# Altium schematic sheet Ethernet_SD_Card.SchDoc
size A
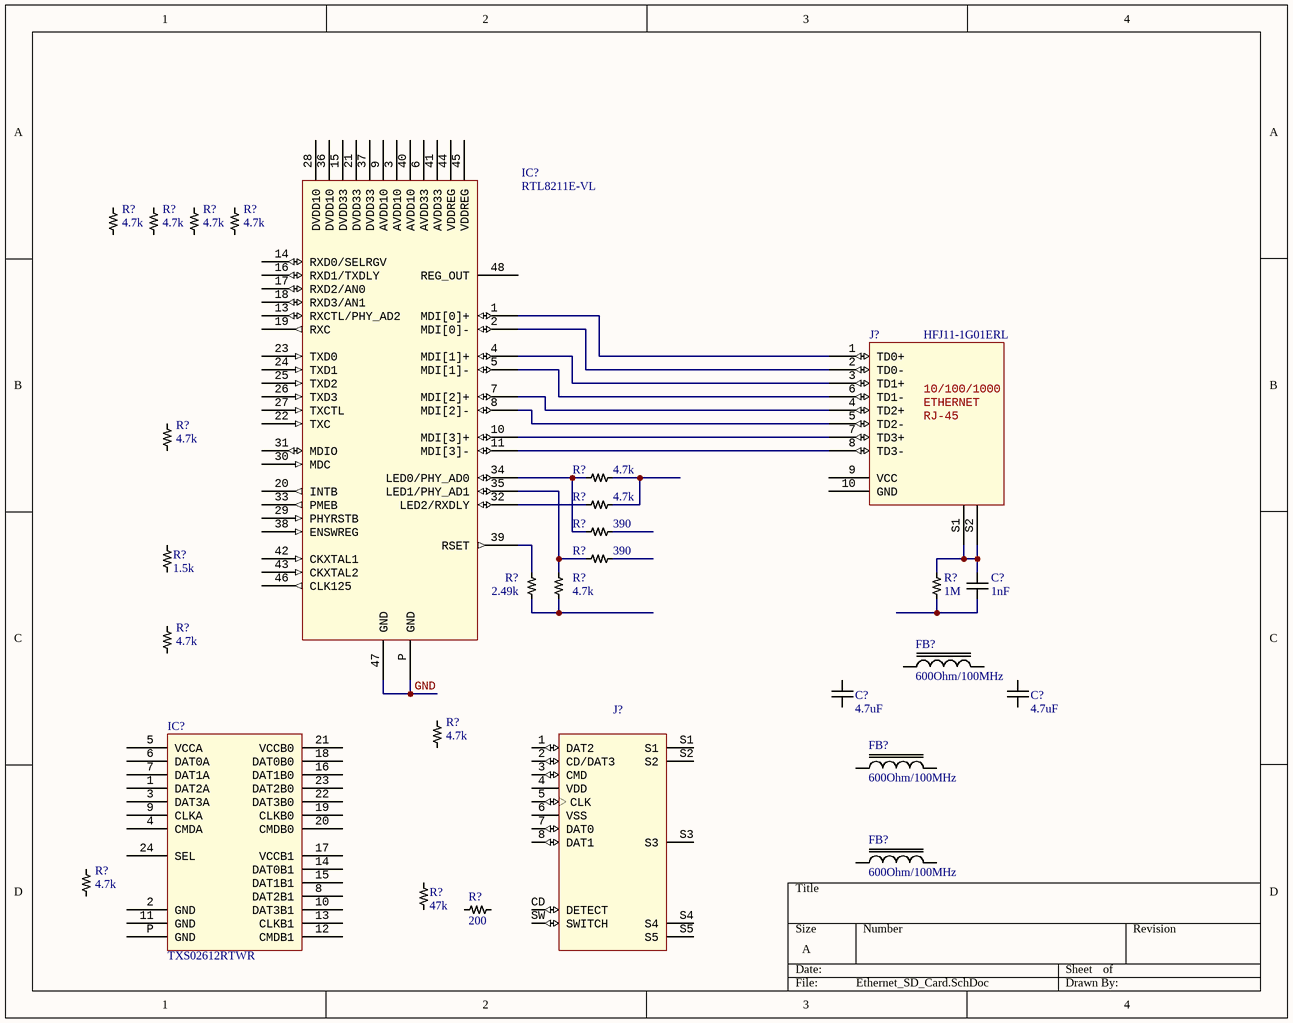
[diagram p0: Ethernet_SD_Card.SchDoc]

## Parts
(Parts that share a designator on the sheet are numbered #1, #2 ... from top to bottom, then left to right.)
C?#1  1nF  [CAP0402]
C?#2  4.7uF  [CAP0805]
C?#3  4.7uF  [CAP0805]
FB?#1  600Ohm/100MHz  [FB0805]
FB?#2  600Ohm/100MHz  [FB0805]
FB?#3  600Ohm/100MHz  [FB0805]
IC?#1  RTL8211E-VL  [QFN48]
IC?#2  TXS02612RTWR  [WQFN24]
J?#1  HFJ11-1G01ERL  [HFJ11-1G01ERL]
J?#2  5031821852  [5031821852]  (value not drawn)
R?#1  4.7k  [RES0402]
R?#2  4.7k  [RES0402]
R?#3  4.7k  [RES0402]
R?#4  4.7k  [RES0402]
R?#5  4.7k  [RES0402]
R?#6  4.7k  [RES0402]
R?#7  4.7k  [RES0402]
R?#8  390  [RES0402]
R?#9  1.5k  [RES0402]
R?#10  390  [RES0402]
R?#11  2.49k  [RES0402]
R?#12  4.7k  [RES0402]
R?#13  1M  [RES0402]
R?#14  4.7k  [RES0402]
R?#15  4.7k  [RES0402]
R?#16  4.7k  [RES0402]
R?#17  47k  [RES0402]
R?#18  200  [RES0402]

## Nets
GND: IC?#1.47(GND) IC?#1.P(GND)
NetC?#1_1: C?#1.1 J?#1.S1(SHD1) J?#1.S2(SHD2) R?#13.2
NetC?#1_2: C?#1.2 R?#13.1
NetIC?#1_1: IC?#1.1(MDI[0]+) J?#1.1(TD0+)
NetIC?#1_2: IC?#1.2(MDI[0]-) J?#1.2(TD0-)
NetIC?#1_4: IC?#1.4(MDI[1]+) J?#1.3(TD1+)
NetIC?#1_5: IC?#1.5(MDI[1]-) J?#1.6(TD1-)
NetIC?#1_7: IC?#1.7(MDI[2]+) J?#1.4(TD2+)
NetIC?#1_8: IC?#1.8(MDI[2]-) J?#1.5(TD2-)
NetIC?#1_10: IC?#1.10(MDI[3]+) J?#1.7(TD3+)
NetIC?#1_11: IC?#1.11(MDI[3]-) J?#1.8(TD3-)
NetIC?#1_32: IC?#1.32(LED2/RXDLY) R?#7.2
NetIC?#1_34: IC?#1.34(LED0/PHY_AD0) R?#6.2 R?#8.1
NetIC?#1_35: IC?#1.35(LED1/PHY_AD1) R?#10.1 R?#12.2
NetIC?#1_39: IC?#1.39(RSET) R?#11.2
NetR?#6_1: R?#6.1 R?#7.1
NetR?#11_1: R?#11.1 R?#12.1

Not connected (* = marked no-connect by the designer): C?#2 1 2; C?#3 1 2; FB?#1 1 2; FB?#2 1 2; FB?#3 1 2; IC?#1 3(AVDD10) 6(AVDD33) 9(AVDD10) 13(RXCTL/PHY_AD2) 14(RXD0/SELRGV) 15(DVDD33) 16(RXD1/TXDLY) 17(RXD2/AN0) 18(RXD3/AN1) 19(RXC) 20(INTB) 21(DVDD33) 22(TXC) 23(TXD0) 24(TXD1) 25(TXD2) 26(TXD3) 27(TXCTL) 28(DVDD10) 29(PHYRSTB) 30(MDC) 31(MDIO) 33(PMEB) 36(DVDD10) 37(DVDD33) 38(ENSWREG) 40(AVDD10) 41(AVDD33) 42(CKXTAL1) 43(CKXTAL2) 44(VDDREG) 45(VDDREG) 46(CLK125) 48(REG_OUT); IC?#2 1(DAT2A) 2(GND) 3(DAT3A) 4(CMDA) 5(VCCA) 6(DAT0A) 7(DAT1A) 8(DAT2B1) 9(CLKA) 10(DAT3B1) 11(GND) 12(CMDB1) 13(CLKB1) 14(DAT0B1) 15(DAT1B1) 16(DAT1B0) 17(VCCB1) 18(DAT0B0) 19(CLKB0) 20(CMDB0) 21(VCCB0) 22(DAT3B0) 23(DAT2B0) 24(SEL) P(GND); J?#1 9(VCC) 10(GND); J?#2 1(DAT2) 2(CD/DAT3) 3(CMD) 4(VDD) 5(CLK) 6(VSS) 7(DAT0) 8(DAT1) CD(DETECT) S1 S2 S3 S4 S5 SW(SWITCH); R?#1 1 2; R?#2 1 2; R?#3 1 2; R?#4 1 2; R?#5 1 2; R?#8 2; R?#9 1 2; R?#10 2; R?#14 1 2; R?#15 1 2; R?#16 1 2; R?#17 1 2; R?#18 1 2

## Notes on the sheet
- (in symbol HFJ11-1G01ERL) 10/100/1000; ETHERNET; RJ-45

## Library data of the parts
C?#1 = GCM155R71H102KA37D: MLCC 1nF 0402 SMD; Manufacturer: Murata; Voltage Rating: 50V; Tolerance: 10%; Dielectric: X7R; Supplier 1: Digi-Key; Manufacturer Part Number: GCM155R71H102KA37D; Stock 1: 18060146; Pricing 1: 1=0.10000, 10=0.03900, 100=0.01720, 500=0.01228, 1000=0.00965, 2500=0.00878, 5000=0.00807 (USD); RoHS: Yes; Mount: Surface Mount; Case/Package: 0402; Case Code (Metric): 1005; Case Code (Imperial): 0402; Min Operating Temperature: -55°C; Max Operating Temperature: 125°C; Package Quantity: 1; Capacitance: 1nF; Packaging: Tape and Reel; Voltage Rating (DC): 50V; Termination: SMD/SMT; Voltage: 50V; Length: 1mm; Height: 0.5mm; Width: 0.02inch; Thickness: 0.022inch; Depth: 0.5mm; Ratings: AEC-Q200; Radiation Hardening: No; REACH SVHC: No SVHC; Lead Free: Lead Free; ComponentLink1URL: https://datasheet.ciiva.com/130/product-130720.pdf?src-supplier=Digi-Key; ComponentLink1Description: https://datasheet.ciiva.com/130/product-130720.pdf?src-supplier=Digi-Key; ComponentLink2URL: https://datasheet.ciiva.com/18183/getdatasheetpartid-140970-18183520.pdf?src-supplier=Verical; ComponentLink2Description: https://datasheet.ciiva.com/18183/getdatasheetpartid-140970-18183520.pdf?src-supplier=Verical; ComponentLink3URL: https://datasheet.ciiva.com/3778/3103gcm155r71h102ka3723-3778878.pdf?src-supplier=Arrow; ComponentLink3Description: https://datasheet.ciiva.com/3778/3103gcm155r71h102ka3723-3778878.pdf?src-supplier=Arrow; ComponentLink4URL: https://datasheet.ciiva.com/11786/0900766b80ef92d0-11786143.pdf?src-supplier=RSComponents; ComponentLink4Description: https://datasheet.ciiva.com/11786/0900766b80ef92d0-11786143.pdf?src-supplier=RSComponents; ComponentLink5URL: https://datasheet.ciiva.com/16213/product-16213384.pdf?src-supplier=Future+Electronics; ComponentLink5Description: https://datasheet.ciiva.com/16213/product-16213384.pdf?src-supplier=Future+Electronics
C?#2 C?#3 = C2012X7R1A475K085AC: MLCC 4.7uF 0805 SMD; Manufacturer: TDK; Dielectric Material: Ceramic; Tolerance: 10%; Voltage Rating: 10V; Dielectric: X7R; Supplier 1: Digi-Key; Manufacturer Part Number: C2012X7R1A475K085AC; Stock 1: 87407; Pricing 1: 1=0.22000, 10=0.15200, 100=0.08600, 500=0.06072, 1000=0.05313 (USD); RoHS: Yes; Mount: Surface Mount; Case/Package: 0805; Case Code (Metric): 2012; Case Code (Imperial): 0805; Min Operating Temperature: -55°C; Max Operating Temperature: 125°C; Package Quantity: 4000; Packaging: Cut Tape; Capacitance: 4.7uF; Voltage Rating (DC): 10V; Length: 0.079inch; Width: 0.049inch; Thickness: 0.039inch; REACH SVHC: No SVHC; Lead Free: Lead Free; ComponentLink1URL: https://datasheet.ciiva.com/14886/tdkmlcccaprange-14886121.pdf?src-supplier=Digi-Key; ComponentLink1Description: https://datasheet.ciiva.com/14886/tdkmlcccaprange-14886121.pdf?src-supplier=Digi-Key; ComponentLink2Description: https://product.tdk.com/info/en/catalog/datasheets/mlcc_commercial_general_en.pdf; ComponentLink2URL: https://product.tdk.com/info/en/catalog/datasheets/mlcc_commercial_general_en.pdf
FB?#1-FB?#3 = HZ0805E601R-10: Ferrite Bead 600Ohm/100MHz 0805 SMD; Manufacturer: Laird; Current Rating: 500mA; Impedance: 600R; Number of Lines: 1; DC Resistance (DCR): 300mR; Test Frequency: 100MHz; Supplier 1: Digi-Key; Manufacturer Part Number: HZ0805E601R-10; Stock 1: 4500868; Pricing 1: 1=0.10000, 10=0.04700, 25=0.04160, 50=0.03800, 100=0.03420, 250=0.02504, 500=0.01822, 1000=0.01784 (USD); RoHS: Yes; Mount: Surface Mount; Case/Package: 0805; Weight: 0.00392oz; Case Code (Metric): 2012; Case Code (Imperial): 0805; Material: Ferrite; Contact Plating: Tin,Matte; Core Material: Ferrite; Min Operating Temperature: -40°C; Max Operating Temperature: 125°C; Package Quantity: 1; Packaging: Tape and Reel; Max Current Rating: 500mA; Max DC Current: 500mA; Termination: SMD/SMT; Frequency: 100MHz; Length: 2mm; Height: 1.25mm; Width: 0.049inch; Depth: 1.45mm; REACH SVHC: Unknown; Lead Free: Lead Free; ComponentLink1URL: https://datasheet.ciiva.com/22622/1685710-22622833.pdf?src-supplier=Element14; ComponentLink1Description: https://datasheet.ciiva.com/22622/1685710-22622833.pdf?src-supplier=Element14; ComponentLink2URL: https://datasheet.ciiva.com/1013/hz0805e601r-10-1013170.pdf?src-supplier=Digi-Key; ComponentLink2Description: https://datasheet.ciiva.com/1013/hz0805e601r-10-1013170.pdf?src-supplier=Digi-Key; ComponentLink3URL: https://datasheet.ciiva.com/8512/hz0805e601r-10-a-vp-8512772.pdf?src-supplier=Avnet; ComponentLink3Description: https://datasheet.ciiva.com/8512/hz0805e601r-10-a-vp-8512772.pdf?src-supplier=Avnet; ComponentLink4URL: https://datasheet.ciiva.com/16714/70065439-16714006.pdf?src-supplier=Allied+Electronics; ComponentLink4Description: https://datasheet.ciiva.com/16714/70065439-16714006.pdf?src-supplier=Allied+Electronics
IC?#1 = RTL8211E-VL: Ethernet transceiver
IC?#2 = TXS02612RTWR: SDIO Port Expander 24WQFN; Manufacturer: Texas Instruments; Min Supply Voltage: 1.1V; Max Supply Voltage: 3.6V; Operating Supply Current: 36uA; Frequency: 60MHz; Number of Outputs: 12; Number of Bits: 4; Supplier 1: Digi-Key; Manufacturer Part Number: TXS02612RTWR; Stock 1: 47945; Pricing 1: 1=1.41000, 10=1.25800, 100=0.98080, 500=0.81020, 1000=0.63963 (USD); RoHS: Yes; Mount: Surface Mount; Number of Pins: 24; Contact Plating: Gold; Min Operating Temperature: -40°C; Max Operating Temperature: 85°C; Packaging: Tape and Reel; Package Quantity: 1; Interface: SDIO; Length: 4.15mm; Height: 0.75mm; Width: 4.15mm; Radiation Hardening: No; REACH SVHC: No SVHC; Lead Free: Lead Free; ComponentLink1URL: https://datasheet.ciiva.com/14194/txs02612-14194898.pdf?src-supplier=Avnet; ComponentLink1Description: https://datasheet.ciiva.com/14194/txs02612-14194898.pdf?src-supplier=Avnet; ComponentLink2URL: https://datasheet.ciiva.com/22652/1723912-22652098.pdf?src-supplier=Element14; ComponentLink2Description: https://datasheet.ciiva.com/22652/1723912-22652098.pdf?src-supplier=Element14; ComponentLink3URL: https://datasheet.ciiva.com/1784/txs02612-1784272.pdf?src-supplier=Digi-Key; ComponentLink3Description: https://datasheet.ciiva.com/1784/txs02612-1784272.pdf?src-supplier=Digi-Key; ComponentLink4URL: https://datasheet.ciiva.com/15134/getdatasheetpartid-225882-15134505.pdf?src-supplier=Verical; ComponentLink4Description: https://datasheet.ciiva.com/15134/getdatasheetpartid-225882-15134505.pdf?src-supplier=Verical; ComponentLink5URL: https://datasheet.ciiva.com/41460/001188030-da-01-en-ic-sdio-port-ex-txs02612rtwr-wqfn-24-tid-41460267.pdf?src-supplier=Conrad; ComponentLink5Description: https://datasheet.ciiva.com/41460/001188030-da-01-en-ic-sdio-port-ex-txs02612rtwr-wqfn-24-tid-41460267.pdf?src-supplier=Conrad
J?#1 = HFJ11-1G01ERL: Ethernet Jack; Manufacturer: HALO; Number of Contacts: 8; Number of Ports: 1; Gender: Female; Pitch: 2.54mm; Supplier 1: Avnet; Manufacturer Part Number: HFJ11-1G01ERL; Stock 1: 332; Pricing 1: 1=3.29546, 10=3.24930, 25=3.20442, 50=3.16076, 100=3.06878 (USD); RoHS: Yes; Mount: Through Hole; Case/Package: Module; Min Operating Temperature: 0°C; Max Operating Temperature: 70°C; Termination: Solder; Orientation: Right Angle; Packaging: Rail/Tube; Number of Positions Loaded: 8; Length: 15.88mm; Width: 15.88mm; Depth: 21.59mm; Radiation Hardening: No; Lead Free: Lead Free; ComponentLink1URL: https://datasheet.ciiva.com/11767/0900766b812ae499-11767976.pdf?src-supplier=RSComponents; ComponentLink1Description: https://datasheet.ciiva.com/11767/0900766b812ae499-11767976.pdf?src-supplier=RSComponents; ComponentLink2URL: https://datasheet.ciiva.com/16649/fastjack-gigabit-16649403.pdf?src-supplier=Avnet+Europe; ComponentLink2Description: https://datasheet.ciiva.com/16649/fastjack-gigabit-16649403.pdf?src-supplier=Avnet+Europe; ComponentLink3URL: https://datasheet.ciiva.com/3139/fastjack-gigabit-3139132.pdf?src-supplier=Avnet; ComponentLink3Description: https://datasheet.ciiva.com/3139/fastjack-gigabit-3139132.pdf?src-supplier=Avnet; ComponentLink4URL: https://datasheet.ciiva.com/16287/fastjack-gigabit-16287901.pdf?src-supplier=Future+Electronics; ComponentLink4Description: https://datasheet.ciiva.com/16287/fastjack-gigabit-16287901.pdf?src-supplier=Future+Electronics
J?#2 = 5031821852: MICRO SD NORMAL ULTRALOWPRO8CKTE; MF: Molex; Digi-Key_Part_Number: WM12834CT-ND; SnapEDA_Link: https://www.snapeda.com/parts/5031821852/Molex/view-part/?ref=snap; Package: None; MP: 5031821852; Digi-Key_Purchase_URL: https://www.digikey.com/product-detail/en/molex/5031821852/WM12834CT-ND/5823232?utm_source=snapeda&utm_medium=aggregator&utm_campaign=symbol; Value: *
R?#1-R?#7 R?#12 R?#14-R?#16 = RC0402FR-074K7L: Resistor 4.7kOhm 0402 SMD; Manufacturer: Yageo; Voltage Rating (DC): 50V; Tolerance: 1%; Power Rating: 62.5mW; Resistance: 4.7kR; Temperature Coefficient: 100ppm/°C; Supplier 1: Digi-Key; Manufacturer Part Number: RC0402FR-074K7L; Stock 1: 23742940; Pricing 1: 1=0.10000, 10=0.01600, 100=0.00670, 1000=0.00301, 2500=0.00261, 5000=0.00215 (USD); RoHS: Yes; Case/Package: 0402; Number of Pins: 2; Case Code (Imperial): 0402; Case Code (Metric): 1005; Min Operating Temperature: -55°C; Max Operating Temperature: 155°C; Voltage Rating: 50V; Packaging: Tape and Reel; Composition: Thick Film; Termination: SMD/SMT; Military Standard: Not; Length: 1mm; Height: 0.32mm; Width: 0.5mm; Depth: 0.5mm; REACH SVHC: No SVHC; Lead Free: Lead Free; ComponentLink1URL: https://datasheet.ciiva.com/7850/1018594-7850022.pdf?src-supplier=Element14; ComponentLink1Description: https://datasheet.ciiva.com/7850/1018594-7850022.pdf?src-supplier=Element14; ComponentLink2URL: https://datasheet.ciiva.com/7850/1018594-7850023.pdf?src-supplier=Element14; ComponentLink2Description: https://datasheet.ciiva.com/7850/1018594-7850023.pdf?src-supplier=Element14; ComponentLink3URL: https://datasheet.ciiva.com/15215/getdatasheetpartid-328119-15215035.pdf?src-supplier=Verical; ComponentLink3Description: https://datasheet.ciiva.com/15215/getdatasheetpartid-328119-15215035.pdf?src-supplier=Verical; ComponentLink4URL: https://datasheet.ciiva.com/22661/1686128-22661342.pdf?src-supplier=Element14; ComponentLink4Description: https://datasheet.ciiva.com/22661/1686128-22661342.pdf?src-supplier=Element14
R?#8 R?#10 = RC0402FR-07390RL: Resistor 390Ohm 0402 SMD; Manufacturer: Yageo; Resistance: 390R; Tolerance: 1%; Power Rating: 63mW; Voltage Rating: 50V; Temperature Coefficient: 100ppm/°C; Supplier 1: Digi-Key; Manufacturer Part Number: RC0402FR-07390RL; Stock 1: 362323; Pricing 1: 1=0.10000, 10=0.01600, 100=0.00670, 1000=0.00301, 2500=0.00261, 5000=0.00215 (USD); RoHS: Yes; Case/Package: 0402; Weight: 2.3E-05oz; Case Code (Imperial): 0402; Case Code (Metric): 1005; Min Operating Temperature: -55°C; Max Operating Temperature: 155°C; Composition: Thick Film; Packaging: Tape and Reel; Package Quantity: 1; Termination: SMD/SMT; Number of Terminations: 2; Military Standard: Not; Max Power Dissipation: 63mW; Working Voltage: 50V; Features: Moisture Resistant; Length: 1mm; Height: 0.016inch; Width: 0.5mm; Depth: 0.5mm; REACH SVHC: Unknown; Lead Free: Lead Free; ComponentLink1URL: https://datasheet.ciiva.com/11819/0900766b80c66297-11819482.pdf?src-supplier=RSComponents; ComponentLink1Description: https://datasheet.ciiva.com/11819/0900766b80c66297-11819482.pdf?src-supplier=RSComponents; ComponentLink2URL: https://datasheet.ciiva.com/16742/pyu-rc0402-51-rohs-l-6-r-16742218.pdf?src-supplier=Future+Electronics; ComponentLink2Description: https://datasheet.ciiva.com/16742/pyu-rc0402-51-rohs-l-6-r-16742218.pdf?src-supplier=Future+Electronics; ComponentLink3URL: https://datasheet.ciiva.com/2519/pyu-r-int-thick-7-2519165.pdf?src-supplier=Digi-Key; ComponentLink3Description: https://datasheet.ciiva.com/2519/pyu-r-int-thick-7-2519165.pdf?src-supplier=Digi-Key; ComponentLink4URL: https://datasheet.ciiva.com/2519/pyu-r-int-thick-7-2519167.pdf?src-supplier=Digi-Key; ComponentLink4Description: https://datasheet.ciiva.com/2519/pyu-r-int-thick-7-2519167.pdf?src-supplier=Digi-Key; ComponentLink5URL: https://datasheet.ciiva.com/7849/1018594-7849978.pdf?src-supplier=Element14; ComponentLink5Description: https://datasheet.ciiva.com/7849/1018594-7849978.pdf?src-supplier=Element14; ComponentLink6URL: https://datasheet.ciiva.com/7849/1018594-7849979.pdf?src-supplier=Element14; ComponentLink6Description: https://datasheet.ciiva.com/7849/1018594-7849979.pdf?src-supplier=Element14; ComponentLink7URL: https://datasheet.ciiva.com/2519/pyu-r-int-thick-7-2519166.pdf?src-supplier=Digi-Key; ComponentLink7Description: https://datasheet.ciiva.com/2519/pyu-r-int-thick-7-2519166.pdf?src-supplier=Digi-Key
R?#9 = RC0402FR-071K5L: Resistor 1.5kOhm 0402 SMD; Manufacturer: Yageo; Resistance: 1.5kR; Power Rating: 62.5mW; Tolerance: 1%; Voltage Rating: 50V; Temperature Coefficient: 100ppm/°C; Max Power Dissipation: 63mW; Supplier 1: Digi-Key; Manufacturer Part Number: RC0402FR-071K5L; Stock 1: 9153842; Pricing 1: 1=0.10000, 10=0.01600, 100=0.00670, 1000=0.00301, 2500=0.00261, 5000=0.00215 (USD); RoHS: Yes; Case/Package: 0402; Case Code (Metric): 1005; Case Code (Imperial): 0402; Min Operating Temperature: -55°C; Max Operating Temperature: 155°C; Composition: Thick Film; Package Quantity: 1; Packaging: Tape and Reel; Number of Terminations: 2; Termination: SMD/SMT; Military Standard: Not; Features: Moisture Resistant; Length: 1mm; Height: 0.016inch; Width: 0.02inch; Depth: 0.5mm; REACH SVHC: No SVHC; Lead Free: Lead Free; ComponentLink1URL: https://datasheet.ciiva.com/11808/0900766b80c66297-11808238.pdf?src-supplier=RSComponents; ComponentLink1Description: https://datasheet.ciiva.com/11808/0900766b80c66297-11808238.pdf?src-supplier=RSComponents; ComponentLink2URL: https://datasheet.ciiva.com/2453/pyu-r-int-thick-7-2453440.pdf?src-supplier=Digi-Key; ComponentLink2Description: https://datasheet.ciiva.com/2453/pyu-r-int-thick-7-2453440.pdf?src-supplier=Digi-Key; ComponentLink3URL: https://datasheet.ciiva.com/2453/pyu-r-int-thick-7-2453441.pdf?src-supplier=Digi-Key; ComponentLink3Description: https://datasheet.ciiva.com/2453/pyu-r-int-thick-7-2453441.pdf?src-supplier=Digi-Key; ComponentLink4URL: https://datasheet.ciiva.com/46394/1018594-46394950.pdf?src-supplier=Element14; ComponentLink4Description: https://datasheet.ciiva.com/46394/1018594-46394950.pdf?src-supplier=Element14; ComponentLink5URL: https://datasheet.ciiva.com/7849/1018594-7849863.pdf?src-supplier=Element14; ComponentLink5Description: https://datasheet.ciiva.com/7849/1018594-7849863.pdf?src-supplier=Element14; ComponentLink6URL: https://datasheet.ciiva.com/7849/1018594-7849864.pdf?src-supplier=Element14; ComponentLink6Description: https://datasheet.ciiva.com/7849/1018594-7849864.pdf?src-supplier=Element14; ComponentLink7URL: https://datasheet.ciiva.com/15189/getdatasheetpartid-323992-15189370.pdf?src-supplier=Verical; ComponentLink7Description: https://datasheet.ciiva.com/15189/getdatasheetpartid-323992-15189370.pdf?src-supplier=Verical; ComponentLink8URL: https://datasheet.ciiva.com/12558/pyu-rc0402-51-rohs-l-6-r-8721-12558542.pdf?src-supplier=Mouser; ComponentLink8Description: https://datasheet.ciiva.com/12558/pyu-rc0402-51-rohs-l-6-r-8721-12558542.pdf?src-supplier=Mouser; ComponentLink9URL: https://datasheet.ciiva.com/2453/pyu-r-int-thick-7-2453439.pdf?src-supplier=Digi-Key; ComponentLink9Description: https://datasheet.ciiva.com/2453/pyu-r-int-thick-7-2453439.pdf?src-supplier=Digi-Key
R?#11 = RC0402FR-072K49L: Resistor 2.49kOhm 1% 0402 SMD; Manufacturer: Yageo; Resistance: 2.49kR; Temperature Coefficient: 100ppm/°C; Power Rating: 62.5mW; Voltage Rating: 50V; Max Power Dissipation: 63mW; Supplier 1: Digi-Key; Manufacturer Part Number: RC0402FR-072K49L; Stock 1: 2217524; Pricing 1: 1=0.10000, 10=0.01600, 100=0.00670, 1000=0.00301, 2500=0.00261, 5000=0.00215 (USD); RoHS: Yes; Case/Package: 0402; Contact Plating: Tin,Lead,Matte; Case Code (Metric): 1005; Case Code (Imperial): 0402; Min Operating Temperature: -55°C; Max Operating Temperature: 155°C; Tolerance: 1%; Composition: Thick Film; Package Quantity: 1; Packaging: Tape and Reel; Number of Terminations: 2; Termination: SMD/SMT; Military Standard: Not; Voltage Rating (DC): 50V; Features: Moisture Resistant; Length: 0.039inch; Height: 0.016inch; Width: 0.02inch; Depth: 0.5mm; Radiation Hardening: No; REACH SVHC: No SVHC; Lead Free: Lead Free; ComponentLink1URL: https://datasheet.ciiva.com/2518/pyu-r-int-thick-7-2518987.pdf?src-supplier=Digi-Key; ComponentLink1Description: https://datasheet.ciiva.com/2518/pyu-r-int-thick-7-2518987.pdf?src-supplier=Digi-Key; ComponentLink2URL: https://datasheet.ciiva.com/7983/1018594-7983516.pdf?src-supplier=Element14; ComponentLink2Description: https://datasheet.ciiva.com/7983/1018594-7983516.pdf?src-supplier=Element14; ComponentLink3URL: https://datasheet.ciiva.com/2518/pyu-r-int-thick-7-2518985.pdf?src-supplier=Digi-Key; ComponentLink3Description: https://datasheet.ciiva.com/2518/pyu-r-int-thick-7-2518985.pdf?src-supplier=Digi-Key; ComponentLink4URL: https://datasheet.ciiva.com/2518/pyu-r-int-thick-7-2518986.pdf?src-supplier=Digi-Key; ComponentLink4Description: https://datasheet.ciiva.com/2518/pyu-r-int-thick-7-2518986.pdf?src-supplier=Digi-Key; ComponentLink5URL: https://datasheet.ciiva.com/5558/pyu-rc0402-51-rohs-l-6-r-5558122.pdf?src-supplier=Mouser; ComponentLink5Description: https://datasheet.ciiva.com/5558/pyu-rc0402-51-rohs-l-6-r-5558122.pdf?src-supplier=Mouser; ComponentLink6URL: https://datasheet.ciiva.com/16868/pyu-rc0402-51-rohs-l-6-16868954.pdf?src-supplier=Avnet+Europe; ComponentLink6Description: https://datasheet.ciiva.com/16868/pyu-rc0402-51-rohs-l-6-16868954.pdf?src-supplier=Avnet+Europe; ComponentLink7URL: https://datasheet.ciiva.com/28414/pyu-rc0402-51-rohs-l-6-28414366.pdf?src-supplier=Avnet+Europe; ComponentLink7Description: https://datasheet.ciiva.com/28414/pyu-rc0402-51-rohs-l-6-28414366.pdf?src-supplier=Avnet+Europe
R?#13 = RC0402FR-071ML: Resistor 1MOhm 0402 SMD; Manufacturer: Yageo; Resistance: 1MR; Tolerance: 1%; Power Rating: 63mW; Voltage Rating: 50V; Temperature Coefficient: 100ppm/°C; Supplier 1: Digi-Key; Manufacturer Part Number: RC0402FR-071ML; Stock 1: 12663284; Pricing 1: 1=0.10000, 10=0.01500, 100=0.00620, 1000=0.00278, 2500=0.00242, 5000=0.00200 (USD); RoHS: Yes; Case/Package: 0402; Case Code (Imperial): 0402; Case Code (Metric): 1005; Min Operating Temperature: -55°C; Max Operating Temperature: 155°C; Composition: Thick Film; Packaging: Tape and Reel; Termination: SMD/SMT; Military Standard: Not; Length: 1mm; Height: 0.32mm; Depth: 0.5mm; REACH SVHC: Unknown; Lead Free: Lead Free; ComponentLink1URL: https://datasheet.ciiva.com/11808/0900766b80c66297-11808125.pdf?src-supplier=RSComponents; ComponentLink1Description: https://datasheet.ciiva.com/11808/0900766b80c66297-11808125.pdf?src-supplier=RSComponents; ComponentLink2URL: https://datasheet.ciiva.com/16741/pyu-rc0402-51-rohs-l-6-r-16741081.pdf?src-supplier=Future+Electronics; ComponentLink2Description: https://datasheet.ciiva.com/16741/pyu-rc0402-51-rohs-l-6-r-16741081.pdf?src-supplier=Future+Electronics; ComponentLink3URL: https://datasheet.ciiva.com/46394/1018594-46394951.pdf?src-supplier=Element14; ComponentLink3Description: https://datasheet.ciiva.com/46394/1018594-46394951.pdf?src-supplier=Element14; ComponentLink4URL: https://datasheet.ciiva.com/7849/1018594-7849882.pdf?src-supplier=Element14; ComponentLink4Description: https://datasheet.ciiva.com/7849/1018594-7849882.pdf?src-supplier=Element14; ComponentLink5URL: https://datasheet.ciiva.com/7849/1018594-7849883.pdf?src-supplier=Element14; ComponentLink5Description: https://datasheet.ciiva.com/7849/1018594-7849883.pdf?src-supplier=Element14
R?#17 = RC0402FR-0747KL: Resistor 47kOhm 0402 SMD; Manufacturer: Yageo; Power Rating: 62.5mW; Tolerance: 1%; Temperature Coefficient: 100ppm/°C; Voltage Rating: 50V; Resistance: 47kR; Max Power Dissipation: 63mW; Supplier 1: Digi-Key; Manufacturer Part Number: RC0402FR-0747KL; Stock 1: 9073356; Pricing 1: 1=0.10000, 10=0.01600, 100=0.00670, 1000=0.00301, 2500=0.00261, 5000=0.00215 (USD); RoHS: Yes; Case/Package: 0402; Case Code (Imperial): 0402; Case Code (Metric): 1005; Min Operating Temperature: -55°C; Max Operating Temperature: 155°C; Packaging: Tape and Reel; Package Quantity: 1; Termination: SMD/SMT; Composition: Thick Film; Number of Terminations: 2; Military Standard: Not; Features: Moisture Resistant; Length: 1mm; Height: 0.016inch; Depth: 0.5mm; Width: 0.5mm; REACH SVHC: Unknown; Lead Free: Lead Free; ComponentLink1URL: https://datasheet.ciiva.com/15189/getdatasheetpartid-323748-15189466.pdf?src-supplier=Verical; ComponentLink1Description: https://datasheet.ciiva.com/15189/getdatasheetpartid-323748-15189466.pdf?src-supplier=Verical; ComponentLink2URL: https://datasheet.ciiva.com/2453/pyu-r-int-thick-7-2453389.pdf?src-supplier=Digi-Key; ComponentLink2Description: https://datasheet.ciiva.com/2453/pyu-r-int-thick-7-2453389.pdf?src-supplier=Digi-Key; ComponentLink3URL: https://datasheet.ciiva.com/2453/pyu-r-int-thick-7-2453390.pdf?src-supplier=Digi-Key; ComponentLink3Description: https://datasheet.ciiva.com/2453/pyu-r-int-thick-7-2453390.pdf?src-supplier=Digi-Key; ComponentLink4URL: https://datasheet.ciiva.com/16793/pyu-rc0402-51-rohs-l-6-r-16793430.pdf?src-supplier=Future+Electronics; ComponentLink4Description: https://datasheet.ciiva.com/16793/pyu-rc0402-51-rohs-l-6-r-16793430.pdf?src-supplier=Future+Electronics; ComponentLink5URL: https://datasheet.ciiva.com/46412/1018594-46412839.pdf?src-supplier=Element14; ComponentLink5Description: https://datasheet.ciiva.com/46412/1018594-46412839.pdf?src-supplier=Element14; ComponentLink6URL: https://datasheet.ciiva.com/2453/pyu-r-int-thick-7-2453388.pdf?src-supplier=Digi-Key; ComponentLink6Description: https://datasheet.ciiva.com/2453/pyu-r-int-thick-7-2453388.pdf?src-supplier=Digi-Key
R?#18 = RC0402FR-07200RL: Resistor 200Ohm 0402 SMD; Manufacturer: Yageo; Tolerance: 1%; Temperature Coefficient: 100ppm/°C; Resistance: 200R; Power Rating: 63mW; Voltage Rating (DC): 50V; Supplier 1: Digi-Key; Manufacturer Part Number: RC0402FR-07200RL; Stock 1: 6380122; Pricing 1: 1=0.10000, 10=0.01600, 100=0.00670, 1000=0.00301, 2500=0.00261, 5000=0.00215 (USD); RoHS: Yes; Case/Package: 0402; Case Code (Metric): 1005; Case Code (Imperial): 0402; Min Operating Temperature: -55°C; Max Operating Temperature: 155°C; Composition: Thick Film; Packaging: Tape and Reel; Voltage Rating: 50V; Package Quantity: 1; Number of Terminations: 2; Termination: SMD/SMT; Military Standard: Not; Max Power Dissipation: 63mW; Features: Moisture Resistant; Length: 1mm; Height: 0.016inch; Depth: 0.5mm; Width: 0.02inch; REACH SVHC: No SVHC; Lead Free: Lead Free; ComponentLink1URL: https://datasheet.ciiva.com/16804/pyu-rc0402-51-rohs-l-6-r-16804406.pdf?src-supplier=Future+Electronics; ComponentLink1Description: https://datasheet.ciiva.com/16804/pyu-rc0402-51-rohs-l-6-r-16804406.pdf?src-supplier=Future+Electronics; ComponentLink2URL: https://datasheet.ciiva.com/5562/pyu-rc0402-51-rohs-l-6-r-8721-5562539.pdf?src-supplier=Mouser; ComponentLink2Description: https://datasheet.ciiva.com/5562/pyu-rc0402-51-rohs-l-6-r-8721-5562539.pdf?src-supplier=Mouser; ComponentLink3URL: https://datasheet.ciiva.com/2553/pyu-r-int-thick-7-2553232.pdf?src-supplier=Digi-Key; ComponentLink3Description: https://datasheet.ciiva.com/2553/pyu-r-int-thick-7-2553232.pdf?src-supplier=Digi-Key; ComponentLink4URL: https://datasheet.ciiva.com/7983/1018594-7983509.pdf?src-supplier=Element14; ComponentLink4Description: https://datasheet.ciiva.com/7983/1018594-7983509.pdf?src-supplier=Element14; ComponentLink5URL: https://datasheet.ciiva.com/15189/getdatasheetpartid-331152-15189383.pdf?src-supplier=Verical; ComponentLink5Description: https://datasheet.ciiva.com/15189/getdatasheetpartid-331152-15189383.pdf?src-supplier=Verical; ComponentLink6URL: https://datasheet.ciiva.com/7849/1018594-7849898.pdf?src-supplier=Element14; ComponentLink6Description: https://datasheet.ciiva.com/7849/1018594-7849898.pdf?src-supplier=Element14; ComponentLink7URL: https://datasheet.ciiva.com/7849/1018594-7849899.pdf?src-supplier=Element14; ComponentLink7Description: https://datasheet.ciiva.com/7849/1018594-7849899.pdf?src-supplier=Element14; ComponentLink8URL: https://datasheet.ciiva.com/2553/pyu-r-int-thick-7-2553230.pdf?src-supplier=Digi-Key; ComponentLink8Description: https://datasheet.ciiva.com/2553/pyu-r-int-thick-7-2553230.pdf?src-supplier=Digi-Key; ComponentLink9URL: https://datasheet.ciiva.com/2553/pyu-r-int-thick-7-2553231.pdf?src-supplier=Digi-Key; ComponentLink9Description: https://datasheet.ciiva.com/2553/pyu-r-int-thick-7-2553231.pdf?src-supplier=Digi-Key